# Altium project pca10095.PrjPCB (part 1 of 4)
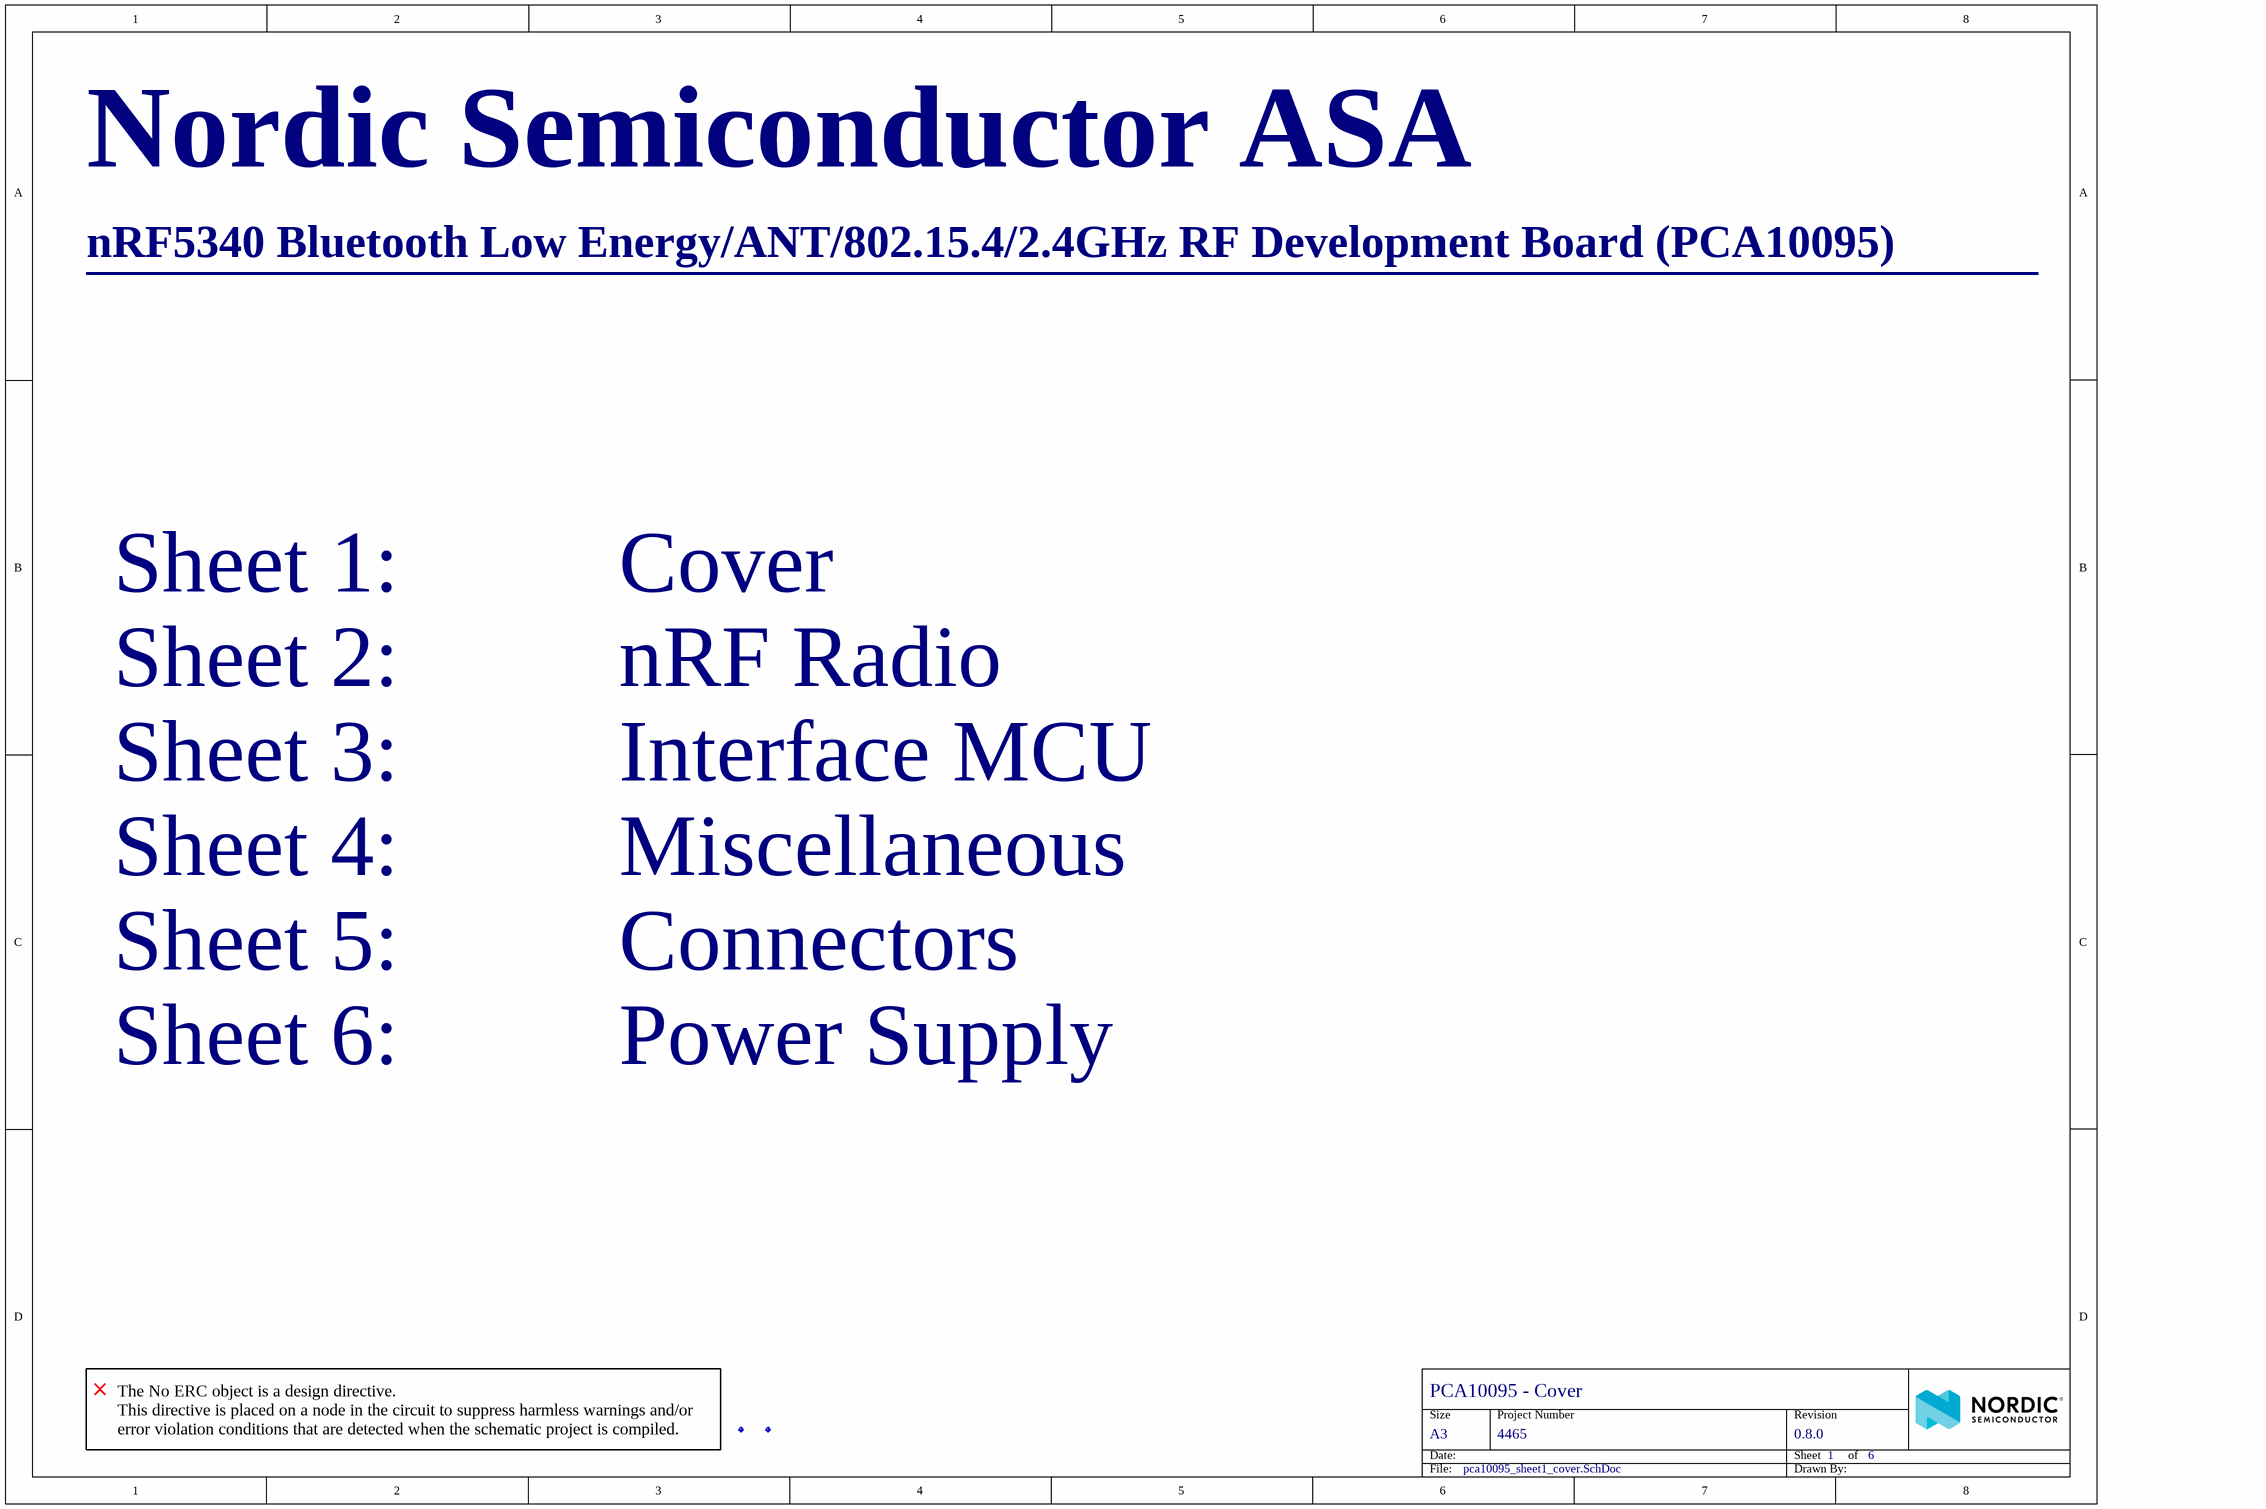
[diagram p0: pca10095_sheet1_cover.SchDoc]
Author: GETR; BoardThickness: 1.6mm; BoardTitle: nRF5340 Bluetooth Smart/ANT/802.15.4/2.4GHz RF Development Board; NrOfLayers: 4; Organization: Nordic Semiconductor; PCAName: PCA10095; PCBNumber: 400432; PCBRevision: 0121GETR; PCBStackup: 4001; ProjectName: nRF53 Development Kit; ProjectNumber: 4465; Revision: 0.8.0; SilkscreenColor: White; SoldermaskColor: Blue; SurfaceFinish: ENIG Gold
6 sheets, 366 parts. Net scope: global (net labels, ports and power ports of the same name join across sheets).
Board file: 400432.PcbDoc
Sheets:
  pca10095_sheet1_cover.SchDoc
  pca10095_sheet2_nrf5340_mcu.SchDoc
  pca10095_sheet3_interface_mcu.SchDoc
  pca10095_sheet4_misc.SchDoc
  pca10095_sheet5_connectors.SchDoc
  pca10095_sheet6_power_supply.SchDoc

## Sheet pca10095_sheet1_cover.SchDoc: PCA10095 - Cover
size A3; Organization: Nordic Semiconductor; DocumentNumber: 1; Revision: 0.8.0; SheetNumber: 1; SheetTotal: 6; Author: GETR; CompanyName: Nordic Semiconductor; DrawnBy: GETR; ProjectName: nRF53 Development Kit

### Parts
Fid1  Fiducial mark  [Fiducial]  (value not drawn)
Fid2  Fiducial mark  [Fiducial]  (value not drawn)

### Notes on the sheet
- Nordic Semiconductor ASA
- nRF5340 Bluetooth Low Energy/ANT/802.15.4/2.4GHz RF Development Board (PCA10095)
- ________________________________________________________________
- Sheet 1:          Cover
- Sheet 2:          nRF Radio
- Sheet 3:          Interface MCU
- Sheet 4:          Miscellaneous
- Sheet 5:          Connectors
- Sheet 6:          Power Supply
- (near Fid1) The No ERC object is a design directive.
  This directive is placed on a node in the circuit to suppress harmless warnings and/or error violation conditions that are detected when the schematic project is compiled.
- Size
- Date:
- A3
- Project Number
- Sheet         of
- Revision
- File:
- Drawn By:

### Library data of the parts
Fid1 Fid2 = Fid-Mark: Artikkelnr Noca: N.A.; Part Number: Fid-Mark; Manufacturer: *; Manufacturer Part Number: *; LatestRevisionDate: 2009-12-12; Pin Count: 1; Publisher: Nordic Semiconductor; Published: 2009-12-12; Value: *; Note: *; Footprint Doc: Fiducial; Part number IPS: N.A.; ComponentLink1URL: *; ComponentLink1Description: Datasheet; ComponentLink2URL: *; ComponentLink2Description: Supplier link; HelpURL: *; Supplier 1: *; Supplier Part Number 1: *; Supplier 2: *; Supplier Part Number 2: *

## Sheet pca10095_sheet2_nrf5340_mcu.SchDoc: PCA10095 - nRF5340 MCU
size A3; Organization: Nordic Semiconductor; DocumentNumber: 2; Revision: 0.8.0; SheetNumber: 2; SheetTotal: 6; Author: GETR; CompanyName: Nordic Semiconductor; DrawnBy: GETR; ProjectName: nRF53 Development Kit
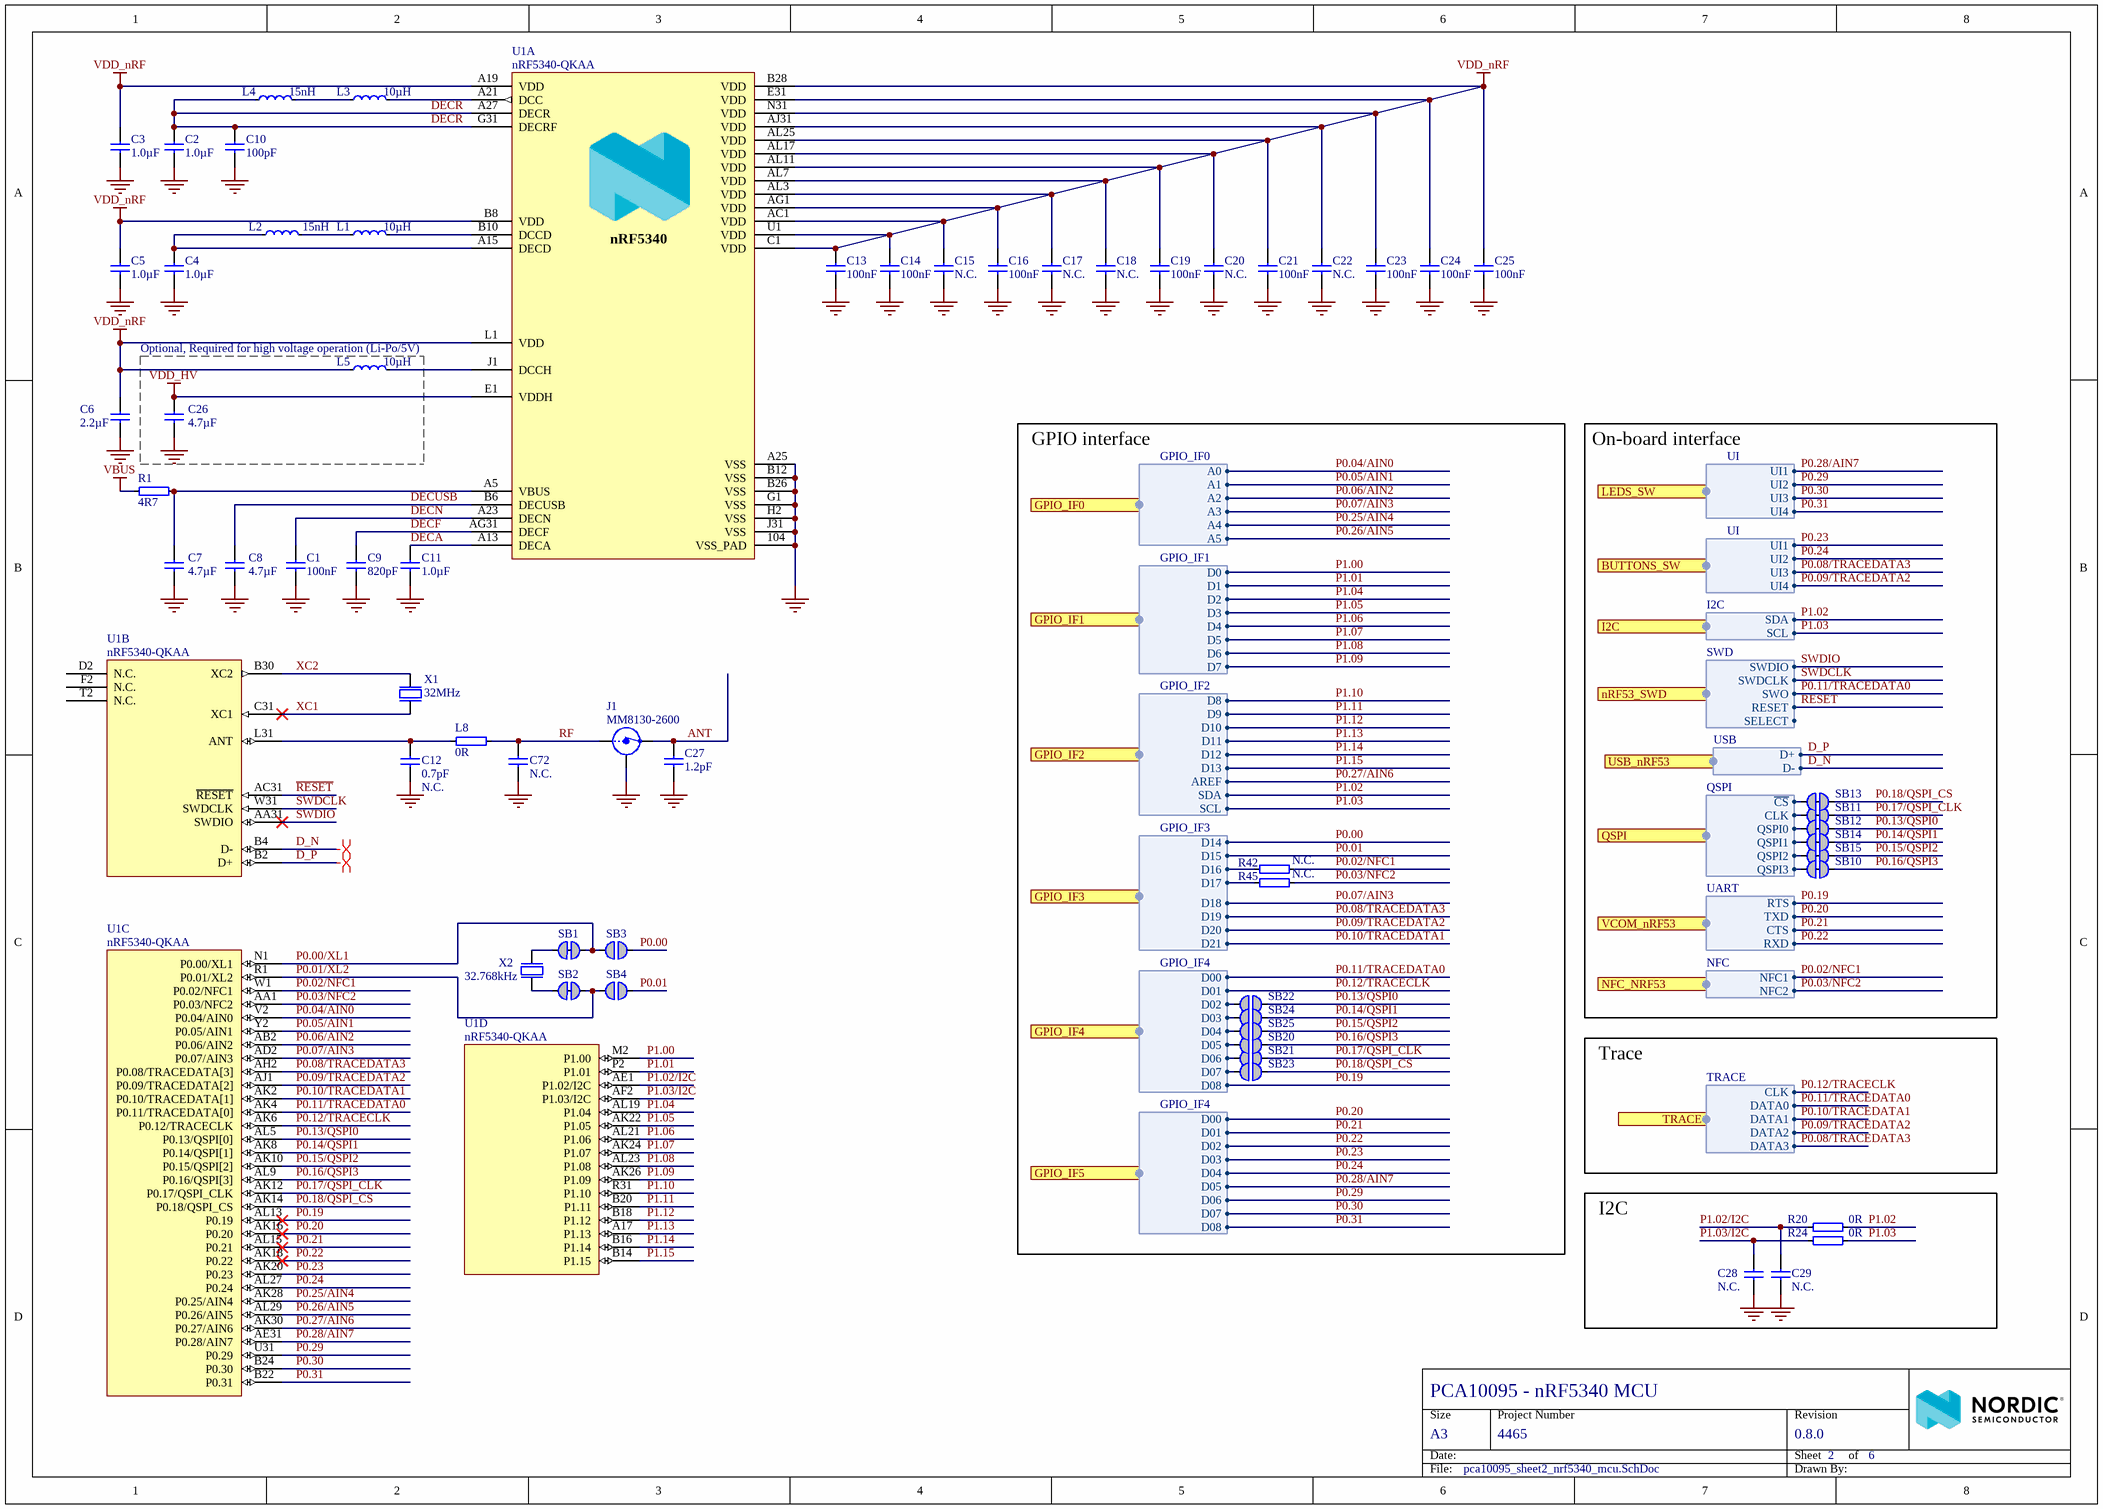
[diagram p1: pca10095_sheet2_nrf5340_mcu.SchDoc]

### Parts
C1  100nF  [CAPC0603X03L_C]
C2  1.0µF  [CAPC1005X04L]
C3  1.0µF  [CAPC1005X04L]
C4  1.0µF  [CAPC1005X04L]
C5  1.0µF  [CAPC1005X04L]
C6  2.2µF  [CAPC1608X06L]
C7  4.7µF  [CAPC1608X06L]
C8  4.7µF  [CAPC1608X06L]
C9  820pF  [CAPC0603X03L_C]
C10  100pF  [CAPC0603X03L_C]
C11  1.0µF  [CAPC1005X04L]
C12  0.7pF  Assembly: N.C.  [CAPC0603X03L_C]
C13  100nF  [CAPC0603X03L_C]
C14  100nF  [CAPC0603X03L_C]
C15  N.C.  [CAPC0603X03L_C]
C16  100nF  [CAPC0603X03L_C]
C17  N.C.  [CAPC0603X03L_C]
C18  N.C.  [CAPC0603X03L_C]
C19  100nF  [CAPC0603X03L_C]
C20  N.C.  [CAPC0603X03L_C]
C21  100nF  [CAPC0603X03L_C]
C22  N.C.  [CAPC0603X03L_C]
C23  100nF  [CAPC0603X03L_C]
C24  100nF  [CAPC0603X03L_C]
C25  100nF  [CAPC0603X03L_C]
C26  4.7µF  [CAPC1608X06L]
C27  1.2pF  [CAPC1005X04L]
C28  N.C.  [CAPC0603X03L_C]
C29  N.C.  [CAPC0603X03L_C]
C72  N.C.  [CAPC0603X03L_C]
J1  MM8130-2600  [COAXIAL-SWF]
L1  10µH  [INDC1608X06L]
L2  15nH  [INDC0603X03L_C]
L3  10µH  [INDC1608X06L]
L4  15nH  [INDC0603X03L_C]
L5  10µH  [INDC1608X06L]
L8  0R  [RESC0603X03L_C]
R1  4R7  [RESC0603X03L_C]
R20  0R  [RESC0603X03L_C]
R24  0R  [RESC0603X03L_C]
R42  N.C.  [RESC0603X03L_C]
R45  N.C.  [RESC0603X03L_C]
SB1  Solderbridge  [Solderbridge_Shorted]  (value not drawn)  (net tie, no BOM)
SB2  Solderbridge  [Solderbridge_Shorted]  (value not drawn)  (net tie, no BOM)
SB3  Solderbridge  [Solderbridge]  (value not drawn)  (no BOM)
SB4  Solderbridge  [Solderbridge]  (value not drawn)  (no BOM)
SB10  Solderbridge  [Solderbridge_Shorted]  (value not drawn)  (net tie, no BOM)
SB11  Solderbridge  [Solderbridge_Shorted]  (value not drawn)  (net tie, no BOM)
SB12  Solderbridge  [Solderbridge_Shorted]  (value not drawn)  (net tie, no BOM)
SB13  Solderbridge  [Solderbridge_Shorted]  (value not drawn)  (net tie, no BOM)
SB14  Solderbridge  [Solderbridge_Shorted]  (value not drawn)  (net tie, no BOM)
SB15  Solderbridge  [Solderbridge_Shorted]  (value not drawn)  (net tie, no BOM)
SB20  Solderbridge  [Solderbridge]  (value not drawn)  (no BOM)
SB21  Solderbridge  [Solderbridge]  (value not drawn)  (no BOM)
SB22  Solderbridge  [Solderbridge]  (value not drawn)  (no BOM)
SB23  Solderbridge  [Solderbridge]  (value not drawn)  (no BOM)
SB24  Solderbridge  [Solderbridge]  (value not drawn)  (no BOM)
SB25  Solderbridge  [Solderbridge]  (value not drawn)  (no BOM)
U1  nRF5340-QKAA  [AQFN40P700X700X85_HS-99N]  (parts A,B,C,D of 4)
X1  32MHz  [BT-XTAL_2016]
X2  32.768kHz  [XTAL_2012]

### Blocks framed on the sheet
Optional, Required for high voltage operation (Li-Po/5V): C26 L5
GPIO interface: R42 R45 SB20-SB25
On-board interface: SB10-SB15
I2C: C28 C29 R20 R24

### Ports
BUTTONS_SW (harness UI), GPIO_IF0 (harness GPIO_IF0), GPIO_IF1 (harness GPIO_IF1), GPIO_IF2 (harness GPIO_IF2), GPIO_IF3 (harness GPIO_IF3), GPIO_IF4 (harness GPIO_IF4), GPIO_IF5 (harness GPIO_IF4), I2C (harness I2C), LEDS_SW (harness UI), NFC_NRF53 (harness NFC), nRF53_SWD (harness SWD), QSPI (harness QSPI), TRACE (harness TRACE), USB_nRF53 (harness USB), VCOM_nRF53 (harness UART)

### Harnesses
QSPI: ~{CS}, QSPI0, CLK, QSPI1, QSPI2, QSPI3
SWD: SWDIO, SWDCLK, SWO, RESET, SELECT
UI: UI4, UI3, UI2, UI1
USB: D+, D-
TRACE: CLK, DATA0, DATA1, DATA3, DATA2
NFC: NFC2, NFC1
UART: RTS, CTS, RXD, TXD
GPIO_IF1: D0, D1, D2, D3, D4, D5, D6, D7
GPIO_IF2: D8, D9, D10, D11, D12, D13, AREF, SDA, SCL
GPIO_IF0: A0, A1, A2, A3, A4, A5
GPIO_IF3: D14, D15, D16, D17, D18, D19, D20, D21
I2C: SCL, SDA
GPIO_IF4: D00, D01, D02, D03, D04, D05, D06, D07, D08

### Nets
GND: C1.2 C2.1 C3.2 C4.1 C5.1 C6.2 C7.2 C8.2 C9.1 C10.2 C11.1 C12.1 C13.2 C14.2 C15.2 C16.2 C17.2 C18.2 C19.2 C20.2 C21.2 C22.2 C23.2 C24.2 C25.2 C26.2 C27.2 C28.1 C29.1 C72.1 J1.2(Shield) U1.104(VSS_PAD) U1.A25(VSS) U1.B12(VSS) U1.B26(VSS) U1.G1(VSS) U1.H2(VSS) U1.J31(VSS) X1.2(GND) X1.4(GND)
VBUS: R1.1
VDD_HV: C26.1 U1.E1(VDDH)
VDD_nRF: C3.1 C5.2 C6.1 C13.1 C14.1 C15.1 C16.1 C17.1 C18.1 C19.1 C20.1 C21.1 C22.1 C23.1 C24.1 C25.1 L5.1 U1.A19(VDD) U1.AC1(VDD) U1.AG1(VDD) U1.AJ31(VDD) U1.AL3(VDD) U1.AL7(VDD) U1.AL11(VDD) U1.AL17(VDD) U1.AL25(VDD) U1.B8(VDD) U1.B28(VDD) U1.C1(VDD) U1.E31(VDD) U1.L1(VDD) U1.N31(VDD) U1.U1(VDD)
ANT: C27.1 J1.3(OUT)
D_N: U1.B4(D-) ; port USB_nRF53.D-
D_P: U1.B2(D+) ; port USB_nRF53.D+
DECA: C11.2 U1.A13(DECA)
DECF: C9.2 U1.AG31(DECF)
DECN: C1.1 U1.A23(DECN)
DECR: C2.2 C10.1 L4.1 U1.A27(DECR) U1.G31(DECRF)
DECUSB: C8.1 U1.B6(DECUSB)
MX25_~{CS}: SB13.2 ; port QSPI.~{CS}
MX25_SCLK: SB11.2 ; port QSPI.CLK
MX25_SIO0: SB12.2 ; port QSPI.QSPI0
MX25_SIO1: SB14.2 ; port QSPI.QSPI1
MX25_SIO2: SB15.2 ; port QSPI.QSPI2
MX25_SIO3: SB10.2 ; port QSPI.QSPI3
P0.00: SB3.2 ; port GPIO_IF3.D14
P0.00/XL1: SB1.2 SB3.1 U1.N1(P0.00/XL1)
P0.01: SB4.2 ; port GPIO_IF3.D15
P0.01/XL2: SB2.2 SB4.1 U1.R1(P0.01/XL2)
P0.02/NFC1: R42.2 U1.W1(P0.02/NFC1) ; port NFC_NRF53.NFC1
P0.03/NFC2: R45.2 U1.AA1(P0.03/NFC2) ; port NFC_NRF53.NFC2
P0.04/AIN0: U1.V2(P0.04/AIN0) ; port GPIO_IF0.A0
P0.05/AIN1: U1.Y2(P0.05/AIN1) ; port GPIO_IF0.A1
P0.06/AIN2: U1.AB2(P0.06/AIN2) ; port GPIO_IF0.A2
P0.07/AIN3: U1.AD2(P0.07/AIN3) ; port GPIO_IF0.A3, port GPIO_IF3.D18
P0.08/TRACEDATA3: U1.AH2(P0.08/TRACEDATA[3]) ; port BUTTONS_SW.UI3, port TRACE.DATA3, port GPIO_IF3.D19
P0.09/TRACEDATA2: U1.AJ1(P0.09/TRACEDATA[2]) ; port BUTTONS_SW.UI4, port TRACE.DATA2, port GPIO_IF3.D20
P0.10/TRACEDATA1: U1.AK2(P0.10/TRACEDATA[1]) ; port TRACE.DATA1, port GPIO_IF3.D21
P0.11/TRACEDATA0: U1.AK4(P0.11/TRACEDATA[0]) ; port nRF53_SWD.SWO, port TRACE.DATA0, port GPIO_IF4.D00
P0.12/TRACECLK: U1.AK6(P0.12/TRACECLK) ; port TRACE.CLK, port GPIO_IF4.D01
P0.13/QSPI0: SB12.1 SB22.1 U1.AL5(P0.13/QSPI[0])
P0.14/QSPI1: SB14.1 SB24.1 U1.AK8(P0.14/QSPI[1])
P0.15/QSPI2: SB15.1 SB25.1 U1.AK10(P0.15/QSPI[2])
P0.16/QSPI3: SB10.1 SB20.1 U1.AL9(P0.16/QSPI[3])
P0.17/QSPI_CLK: SB11.1 SB21.1 U1.AK12(P0.17/QSPI_CLK)
P0.18/QSPI_CS: SB13.1 SB23.1 U1.AK14(P0.18/QSPI_CS)
P0.19: U1.AL13(P0.19) ; port VCOM_nRF53.RTS, port GPIO_IF4.D08
P0.20: U1.AK16(P0.20) ; port VCOM_nRF53.TXD, port GPIO_IF5.D00
P0.21: U1.AL15(P0.21) ; port VCOM_nRF53.CTS, port GPIO_IF5.D01
P0.22: U1.AK18(P0.22) ; port VCOM_nRF53.RXD, port GPIO_IF5.D02
P0.23: U1.AK20(P0.23) ; port BUTTONS_SW.UI1, port GPIO_IF5.D03
P0.24: U1.AL27(P0.24) ; port BUTTONS_SW.UI2, port GPIO_IF5.D04
P0.25/AIN4: U1.AK28(P0.25/AIN4) ; port GPIO_IF0.A4
P0.26/AIN5: U1.AL29(P0.26/AIN5) ; port GPIO_IF0.A5
P0.27/AIN6: U1.AK30(P0.27/AIN6) ; port GPIO_IF2.AREF
P0.28/AIN7: U1.AE31(P0.28/AIN7) ; port LEDS_SW.UI1, port GPIO_IF5.D05
P0.29: U1.U31(P0.29) ; port LEDS_SW.UI2, port GPIO_IF5.D06
P0.30: U1.B24(P0.30) ; port LEDS_SW.UI3, port GPIO_IF5.D07
P0.31: U1.B22(P0.31) ; port LEDS_SW.UI4, port GPIO_IF5.D08
P1.00: U1.M2(P1.00) ; port GPIO_IF1.D0
P1.01: U1.P2(P1.01) ; port GPIO_IF1.D1
P1.02: R20.1 ; port GPIO_IF2.SDA, port I2C.SDA
P1.02/I2C: C29.2 R20.2 U1.AE1(P1.02/I2C)
P1.03: R24.1 ; port GPIO_IF2.SCL, port I2C.SCL
P1.03/I2C: C28.2 R24.2 U1.AF2(P1.03/I2C)
P1.04: U1.AL19(P1.04) ; port GPIO_IF1.D2
P1.05: U1.AK22(P1.05) ; port GPIO_IF1.D3
P1.06: U1.AL21(P1.06) ; port GPIO_IF1.D4
P1.07: U1.AK24(P1.07) ; port GPIO_IF1.D5
P1.08: U1.AL23(P1.08) ; port GPIO_IF1.D6
P1.09: U1.AK26(P1.09) ; port GPIO_IF1.D7
P1.10: U1.R31(P1.10) ; port GPIO_IF2.D8
P1.11: U1.B20(P1.11) ; port GPIO_IF2.D9
P1.12: U1.B18(P1.12) ; port GPIO_IF2.D10
P1.13: U1.A17(P1.13) ; port GPIO_IF2.D11
P1.14: U1.B16(P1.14) ; port GPIO_IF2.D12
P1.15: U1.B14(P1.15) ; port GPIO_IF2.D13
~{RESET}: U1.AC31(~{RESET}) ; port nRF53_SWD.RESET
RF: C72.2 J1.1(IN) L8.2
SWDCLK: U1.W31(SWDCLK) ; port nRF53_SWD.SWDCLK
SWDIO: U1.AA31(SWDIO) ; port nRF53_SWD.SWDIO
XC1: U1.C31(XC1) X1.1(inp)
XC2: U1.B30(XC2) X1.3(out)
NetC4_2: C4.2 L2.1 U1.A15(DECD)
NetC7_1: C7.1 R1.2 U1.A5(VBUS)
NetC12_2: C12.2 L8.1 U1.L31(ANT)
NetL1_1: L1.1 L2.2
NetL1_2: L1.2 U1.B10(DCCD)
NetL3_1: L3.1 L4.2
NetL3_2: L3.2 U1.A21(DCC)
NetL5_2: L5.2 U1.J1(DCCH)
NetP6_3: R42.1 ; port GPIO_IF3.D16
NetP6_4: R45.1 ; port GPIO_IF3.D17
NetP24_3: SB22.2 ; port GPIO_IF4.D02
NetP24_4: SB24.2 ; port GPIO_IF4.D03
NetP24_5: SB25.2 ; port GPIO_IF4.D04
NetP24_6: SB20.2 ; port GPIO_IF4.D05
NetP24_7: SB21.2 ; port GPIO_IF4.D06
NetP24_8: SB23.2 ; port GPIO_IF4.D07
NetSB1_1: SB1.1 X2.1(inp)
NetSB2_1: SB2.1 X2.2(out)

Not connected (* = marked no-connect by the designer): U1 D2(N.C.) F2(N.C.) T2(N.C.)

### Layout directives
differential pair: D_N, D_P

### Notes on the sheet
- D22
- D23
- D24
- D25
- D26
- D27
- D28
- D29
- D30
- D31
- Trace
- D32
- D33
- D34
- D35
- D36
- D37
- D38
- D39
- Size
- Date:
- A3
- Project Number
- Sheet         of
- Revision
- File:
- Drawn By:
- (in symbol nRF5340-QKAAAA, part A) nRF5340

### Library data of the parts
C1 C13 C14 C16 C19 C21 C23-C25 = C0201-100n: Capacitor, X5R, ±10%; Part number IPS: 00000001248; Note: 16V; Artikkelnr Noca: N.A.; Part Number: C0201-100n; Manufacturer: *; Manufacturer Part Number: *; LatestRevisionDate: 2017-11-09; Pin Count: 2; Publisher: Nordic Semiconductor; Published: 2014-11-13; Value: 100nF; Footprint Doc: 0201; ComponentLink1URL: *; ComponentLink1Description: Datasheet; ComponentLink2URL: *; ComponentLink2Description: Supplier link; HelpURL: *; Supplier 1: *; Supplier Part Number 1: *; Supplier 2: *; Supplier Part Number 2: *
C2-C4 C11 = C0402-1µ0: Capacitor, X5R, ±5%; Part number IPS: 00000007786; Note: 6.3V; Artikkelnr Noca: 20039235; Part Number: C0402-1µ0; Manufacturer: *; Manufacturer Part Number: *; LatestRevisionDate: 2016-08-22; Pin Count: 2; Publisher: Nordic Semiconductor; Published: 2009-05-08; Value: 1.0µF; Footprint Doc: 0402; ComponentLink1URL: *; ComponentLink1Description: Datasheet; ComponentLink2URL: *; ComponentLink2Description: Supplier link; HelpURL: *; Supplier 1: Digi-Key; Supplier Part Number 1: 1276-1444-1-ND; Supplier 2: *; Supplier Part Number 2: *
C5 = C0402-1µ0: Capacitor, X5R, ±5%, 6.3V; Part number IPS: 00000007786; Artikkelnr Noca: 20039235; Part Number: C0402-1µ0; Manufacturer: *; Manufacturer Part Number: *; LatestRevisionDate: 2016-08-22; Pin Count: 2; Publisher: Nordic Semiconductor; Published: 2009-05-08; Value: 1.0µF; Note: 6.3V; Footprint Doc: 0402; ComponentLink1URL: *; ComponentLink1Description: Datasheet; ComponentLink2URL: *; ComponentLink2Description: Supplier link; HelpURL: *; Supplier 1: Digi-Key; Supplier Part Number 1: 1276-1444-1-ND; Supplier 2: *; Supplier Part Number 2: *
C6 = C0603-2µ2: Capacitor, X7R, ±10%; Part number IPS: N.A.; Note: 6.3V; Artikkelnr Noca: 20039322; Part Number: C0603-2µ2; Manufacturer: *; Manufacturer Part Number: *; LatestRevisionDate: 2016-10-10; Pin Count: 2; Publisher: Nordic Semiconductor; Published: 2009-05-08; Value: 2.2µF; Footprint Doc: 0603; ComponentLink1URL: *; ComponentLink1Description: Datasheet; ComponentLink2URL: *; ComponentLink2Description: Supplier link; HelpURL: *; Supplier 1: *; Supplier Part Number 1: *; Supplier 2: *; Supplier Part Number 2: *
C7 C8 C26 = C0603-4µ7-10V-X7S: Capacitor, X7S, ±10%; Part number IPS: N.A.; Note: 10V; Artikkelnr Noca: 20030013; Part Number: C0603-4µ7-10V-X7S; LatestRevisionDate: 2016-08-15; Pin Count: 2; Publisher: Nordic Semiconductor; Published: 2016-08-15; Value: 4.7µF; Footprint Doc: 0603; Manufacturer: *; Manufacturer Part Number: *; ComponentLink1URL: *; ComponentLink1Description: Datasheet; ComponentLink2URL: *; ComponentLink2Description: Supplier link; HelpURL: *; Supplier 1: Digi-Key; Supplier Part Number 1: 445-14258-1-ND; Supplier 2: *; Supplier Part Number 2: *
C9 = C0201-820p: Capacitor, X7R, ±10%; Part number IPS: 00000001249; Note: 25V; Artikkelnr Noca: N.A.; Part Number: C0201-820p; Manufacturer: *; Manufacturer Part Number: *; LatestRevisionDate: 2017-11-09; Pin Count: 2; Publisher: Nordic Semiconductor; Published: 2014-11-13; Value: 820pF; Footprint Doc: 0201; ComponentLink1URL: *; ComponentLink1Description: Datasheet; ComponentLink2URL: *; ComponentLink2Description: Supplier link; HelpURL: *; Supplier 1: *; Supplier Part Number 1: *; Supplier 2: *; Supplier Part Number 2: *
C10 = C0201-100p: Capacitor, NP0, ±2%; Part number IPS: 00000007853; Note: 25V; Artikkelnr Noca: N.A.; Part Number: C0201-100p; Manufacturer: *; Manufacturer Part Number: *; LatestRevisionDate: 2017-11-09; Pin Count: 2; Publisher: Nordic Semiconductor; Published: 2014-11-13; Value: 100pF; Footprint Doc: 0201; ComponentLink1URL: *; ComponentLink1Description: Datasheet; ComponentLink2URL: *; ComponentLink2Description: Supplier link; HelpURL: *; Supplier 1: *; Supplier Part Number 1: *; Supplier 2: *; Supplier Part Number 2: *
C12 = C0201-0.7p: Capacitor, NP0, ±0.05pF; Note: 50V; Artikkelnr Noca: N.A.; Part Number: C0201-0.7p; Manufacturer: *; Manufacturer Part Number: *; LatestRevisionDate: 2018-10-22; Pin Count: 2; Publisher: Nordic Semiconductor; Published: 2014-11-13; Value: 0.7pF; Footprint Doc: 0201; ComponentLink1URL: *; ComponentLink1Description: Datasheet; ComponentLink2URL: *; ComponentLink2Description: Supplier link; HelpURL: *; Supplier 1: *; Supplier Part Number 1: *; Supplier 2: *; Supplier Part Number 2: *; Part number IPS: N.A.
C15 C17 C18 C20 C22 = C0201-N.C.: Not mounted; Note: Chip Cap; Artikkelnr Noca: N.A.; Assembly: Not mounted; Part Number: C0201-N.C.; Manufacturer: *; Manufacturer Part Number: *; LatestRevisionDate: 2014-11-13; Pin Count: 2; Publisher: Nordic Semiconductor; Published: 2014-11-13; Value: N.C.; Footprint Doc: 0201; ComponentLink1URL: *; ComponentLink1Description: Datasheet; ComponentLink2URL: *; ComponentLink2Description: Supplier link; HelpURL: *; Supplier 1: *; Supplier Part Number 1: *; Supplier 2: *; Supplier Part Number 2: *; Part number IPS: N.A.
C27 = C0402-1.2p: Capacitor, NP0, ±0.1pF; Part number IPS: 00000005410; Note: 50V; Artikkelnr Noca: 20029157; Artikkelnr Simpro: N.A.; Part Number: C0402-1.2p; Manufacturer: *; Manufacturer Part Number: *; Datasheet: *; LatestRevisionDate: 2011-05-11; Pin Count: 2; Publisher: Nordic Semiconductor; Published: 2009-05-08; Value: 1.2pF; Supplier: *; Supplier part number: *; 2nd source Supplier: *; 2nd source part number: *; Footprint Doc: 0402
C28 C29 = C0201-N.C.: Not mounted; Assembly: Not mounted; Note: Chip Cap; Artikkelnr Noca: N.A.; Part Number: C0201-N.C.; Manufacturer: *; Manufacturer Part Number: *; Footprint Doc: 0201; LatestRevisionDate: 2014-11-13; Pin Count: 2; Publisher: Nordic Semiconductor; Published: 2014-11-13; Value: N.C.; Part number IPS: N.A.; ComponentLink1URL: *; ComponentLink1Description: Datasheet; ComponentLink2URL: *; ComponentLink2Description: Supplier link; HelpURL: *; Supplier 1: *; Supplier Part Number 1: *; Supplier 2: *; Supplier Part Number 2: *
C72 = C0201-N.C.: Not mounted; Note: Chip Cap; Assembly: Not mounted; Artikkelnr Noca: N.A.; Part Number: C0201-N.C.; LatestRevisionDate: 2014-11-13; Pin Count: 2; Publisher: Nordic Semiconductor; Published: 2014-11-13; Value: N.C.; Footprint Doc: 0201; Manufacturer: *; Manufacturer Part Number: *; Part number IPS: N.A.; ComponentLink1URL: *; ComponentLink1Description: Datasheet; ComponentLink2URL: *; ComponentLink2Description: Supplier link; HelpURL: *; Supplier 1: *; Supplier Part Number 1: *; Supplier 2: *; Supplier Part Number 2: *
J1 = MM8130-2600: Coaxial Connector with Switch; Manufacturer: Murata; 2nd source part number: 81-MM8130-2600RA2; Artikkelnr Noca: 55029011; Artikkelnr Simpro: N.A.; Part Number: MM8130-2600; Manufacturer Part Number: MM8130-2600; Datasheet: http://www.murata.com/products/catalog/pdf/o33e.pdf; LatestRevisionDate: 2014-04-24; Pin Count: 3; Publisher: Nordic Semiconductor; Published: 2014-04-24; Value: MM8130-2600; Note: *; Supplier: Digi-Key; Supplier part number: 490-4981-1-ND; 2nd source Supplier: Mouser; Footprint Doc: COAXIAL-SWF
L1 L3 L5 = L0603-10µ-TDK: Inductor, 250mA, ±20%, 1.05ohm. -55°C ~ 125°C; Manufacturer: TDK; Manufacturer Part Number: MLZ1608M100WTD25; Part Number: L0603-10µ-TDK; LatestRevisionDate: 2012-09-19; Pin Count: 2; Publisher: Nordic Semiconductor; Published: 2019-05-06; Value: 10µH; Note: *; Artikkelnr Noca: *; Footprint Doc: 0603; ComponentLink1URL: *; ComponentLink1Description: Datasheet; ComponentLink2URL: *; ComponentLink2Description: Supplier link; HelpURL: https://product.tdk.com/info/en/catalog/datasheets/inductor_automotive_decoupling_mlz1608_en.pdf; Supplier 1: Digi-Key; Supplier Part Number 1: 445-175588-1-ND; Supplier 2: Mouser; Supplier Part Number 2: 810-MLZ1608M100WTD25; Part number IPS: *
L2 L4 = L0201-15n: Inductor, 250mA, ±5%; Manufacturer: Murata; Manufacturer Part Number: LQP03TN15NJ02D; Note: High frequency chip inductor ±10%; Artikkelnr Noca: N.A.; Part Number: L0201-15n; LatestRevisionDate: 2013-04-10; Pin Count: 2; Publisher: Nordic Semiconductor; Published: 2013-04-10; Value: 15nH; Footprint Doc: 0201; ComponentLink1URL: http://search.murata.co.jp/Ceramy/image/img/P02/JELF243C-0015.pdf; ComponentLink1Description: Datasheet; ComponentLink2URL: *; ComponentLink2Description: Supplier link; HelpURL: *; Supplier 1: Digi-Key; Supplier Part Number 1: 490-5570-1-ND; Supplier 2: *; Supplier Part Number 2: *; Part number IPS: N.A.
L8 R20 R24 = R0201-0R: Resistor, ±5%, 0.05W; Part number IPS: 00000003245; Note: Chip Res 5%; Artikkelnr Noca: N.A.; Part Number: R0201-0R; Manufacturer: *; Manufacturer Part Number: *; ComponentLink1URL: *; ComponentLink1Description: Datasheet; ComponentLink2URL: *; ComponentLink2Description: Supplier link; HelpURL: *; Footprint Doc: 0201; LatestRevisionDate: 2017-11-09; Pin Count: 2; Publisher: Nordic Semiconductor; Published: 2014-11-13; Value: 0R; Supplier 1: *; Supplier Part Number 1: *; Supplier 2: *; Supplier Part Number 2: *
R1 = R0201-4R7: Resistor, ±1%, 0.05W; Note: Chip Res 1%; Artikkelnr Noca: N.A.; Part Number: R0201-4R7; Manufacturer: *; Manufacturer Part Number: *; ComponentLink1URL: *; ComponentLink1Description: Datasheet; ComponentLink2URL: *; ComponentLink2Description: Supplier link; HelpURL: *; Footprint Doc: 0201; LatestRevisionDate: 2014-11-13; Pin Count: 2; Publisher: Nordic Semiconductor; Published: 2014-11-13; Value: 4R7; Supplier 1: *; Supplier Part Number 1: *; Supplier 2: *; Supplier Part Number 2: *; Part number IPS: N.A.
R42 R45 = R0201-N.C.: Not mounted; Note: Chip Res; Artikkelnr Noca: N.A.; Part Number: R0201-N.C.; Manufacturer: *; Manufacturer Part Number: *; Footprint Doc: 0201; LatestRevisionDate: 2014-11-13; Pin Count: 2; Publisher: Nordic Semiconductor; Published: 2014-11-13; Value: N.C.; Part number IPS: N.A.; ComponentLink1URL: *; ComponentLink1Description: Datasheet; ComponentLink2URL: *; ComponentLink2Description: Supplier link; HelpURL: *; Supplier 1: *; Supplier Part Number 1: *; Supplier 2: *; Supplier Part Number 2: *
SB1 SB2 SB10-SB15 = Solderbridge Shorted: Shorted Solderbridge; Artikkelnr Noca: N.A.; Part Number: Solderbridge Shorted; Manufacturer: *; Manufacturer Part Number: *; LatestRevisionDate: 2012-08-07; Pin Count: 2; Publisher: Nordic Semiconductor; Published: 2012-08-07; Value: Solderbridge; Note: *; Footprint Doc: Solderbridge_Shorted
  SB1 SB2: Datasheet: *; Supplier: *; Supplier part number: *; 2nd source Supplier: *; 2nd source part number: *; Artikkelnr Simpro: N.A.
  SB10-SB15: Part number IPS: N.A.; ComponentLink1URL: *; ComponentLink1Description: Datasheet; ComponentLink2URL: *; ComponentLink2Description: Supplier link; HelpURL: *; Supplier 1: *; Supplier Part Number 1: *; Supplier 2: *; Supplier Part Number 2: *
SB3 SB4 SB20-SB25 = Solderbridge: Artikkelnr Noca: N.A.; Part Number: Solderbridge; Manufacturer: *; Manufacturer Part Number: *; LatestRevisionDate: 2009-12-14; Pin Count: 2; Publisher: Nordic Semiconductor; Published: 2009-12-14; Value: Solderbridge; Note: *; Footprint Doc: Solderbridge
  SB3 SB4: Datasheet: *; Supplier: *; Supplier part number: *; 2nd source Supplier: *; 2nd source part number: *; Artikkelnr Simpro: N.A.
  SB20-SB25: Part number IPS: N.A.; ComponentLink1URL: *; ComponentLink1Description: Datasheet; ComponentLink2URL: *; ComponentLink2Description: Supplier link; HelpURL: *; Supplier 1: *; Supplier Part Number 1: *; Supplier 2: *; Supplier Part Number 2: *
U1 = nRF5340-QKAAAA: Multi-protocol Bluetooth Low Energy, IEEE 802.15.4, ANT and 2.4GHz proprietary system-on-chip; Manufacturer: Nordic Semiconductor; Artikkelnr Noca: N.A.; Part Number: nRF5340-QKAAAA; Manufacturer Part Number: *; Footprint Doc: AQFN-98; LatestRevisionDate: 2019-03-28; Pin Count: 98; Publisher: Nordic Semiconductor; Published: 2017-01-09; Value: nRF5340-QKAA; Note: *; Part number IPS: N.A.; ComponentLink1URL: *; ComponentLink1Description: Datasheet; ComponentLink2URL: *; ComponentLink2Description: Supplier link; HelpURL: *; Supplier 1: Nordic Semiconductor; Supplier Part Number 1: nRF5340-QKAAAA; Supplier 2: *; Supplier Part Number 2: *
X1 = XTAL_SMD2016_32MHz_8pF_Kyocera_HT: XTAL SMD 2016, 32MHz, Cl=8pF, ±40ppm, -40°C ~ 105°C; Manufacturer Part Number: CX2016DB32000D0WRRC1; Note: XTAL SMD 32.000MHz; Artikkelnr Noca: N.A.; Part Number: XTAL_SMD2016_32MHz_8pF_Kyocera_HT; Manufacturer: Kyocera; LatestRevisionDate: 2015-12-22; Pin Count: 4; Publisher: Nordic Semiconductor; Published: 2015-12-23; Value: 32MHz; Footprint Doc: XTAL_2016; Part number IPS: N.A.; ComponentLink1URL: *; ComponentLink1Description: Datasheet; ComponentLink2URL: *; ComponentLink2Description: Supplier link; HelpURL: http://projecttools.nordicsemi.no/confluence/download/attachments/16544873/CX2016DB32000D0WRRC1%2015236-00.pdf?version=1&modificationDate=1441719736227&api=v2; Supplier 1: *; Supplier Part Number 1: *; Supplier 2: *; Supplier Part Number 2: *
X2 = XTAL_SMD2012_32.768kHz_9pF_General: XTAL SMD 2012, 32.768kHz, Cl=9pF, Total Tol: ±50ppm; Note: XTAL SMD 32.768kHz; Artikkelnr Noca: N.A.; Part Number: XTAL_SMD2012_32.768kHz_9pF_General; Manufacturer: *; Manufacturer Part Number: *; LatestRevisionDate: 2017-01-11; Pin Count: 2; Publisher: Nordic Semiconductor; Published: 2016-08-19; Value: 32.768kHz; Footprint Doc: XTAL_2012; Part number IPS: N.A.; ComponentLink1URL: *; ComponentLink1Description: Datasheet; ComponentLink2URL: *; ComponentLink2Description: Supplier link; HelpURL: *; Supplier 1: *; Supplier Part Number 1: *; Supplier 2: *; Supplier Part Number 2: *

## Sheet pca10095_sheet3_interface_mcu.SchDoc: PCA10095 - Interface MCU
size A3; Organization: Nordic Semiconductor; DocumentNumber: 3; Revision: 0.8.0; SheetNumber: 3; SheetTotal: 6; Author: GETR; CompanyName: Nordic Semiconductor; DrawnBy: GETR; ProjectName: nRF53 Development Kit
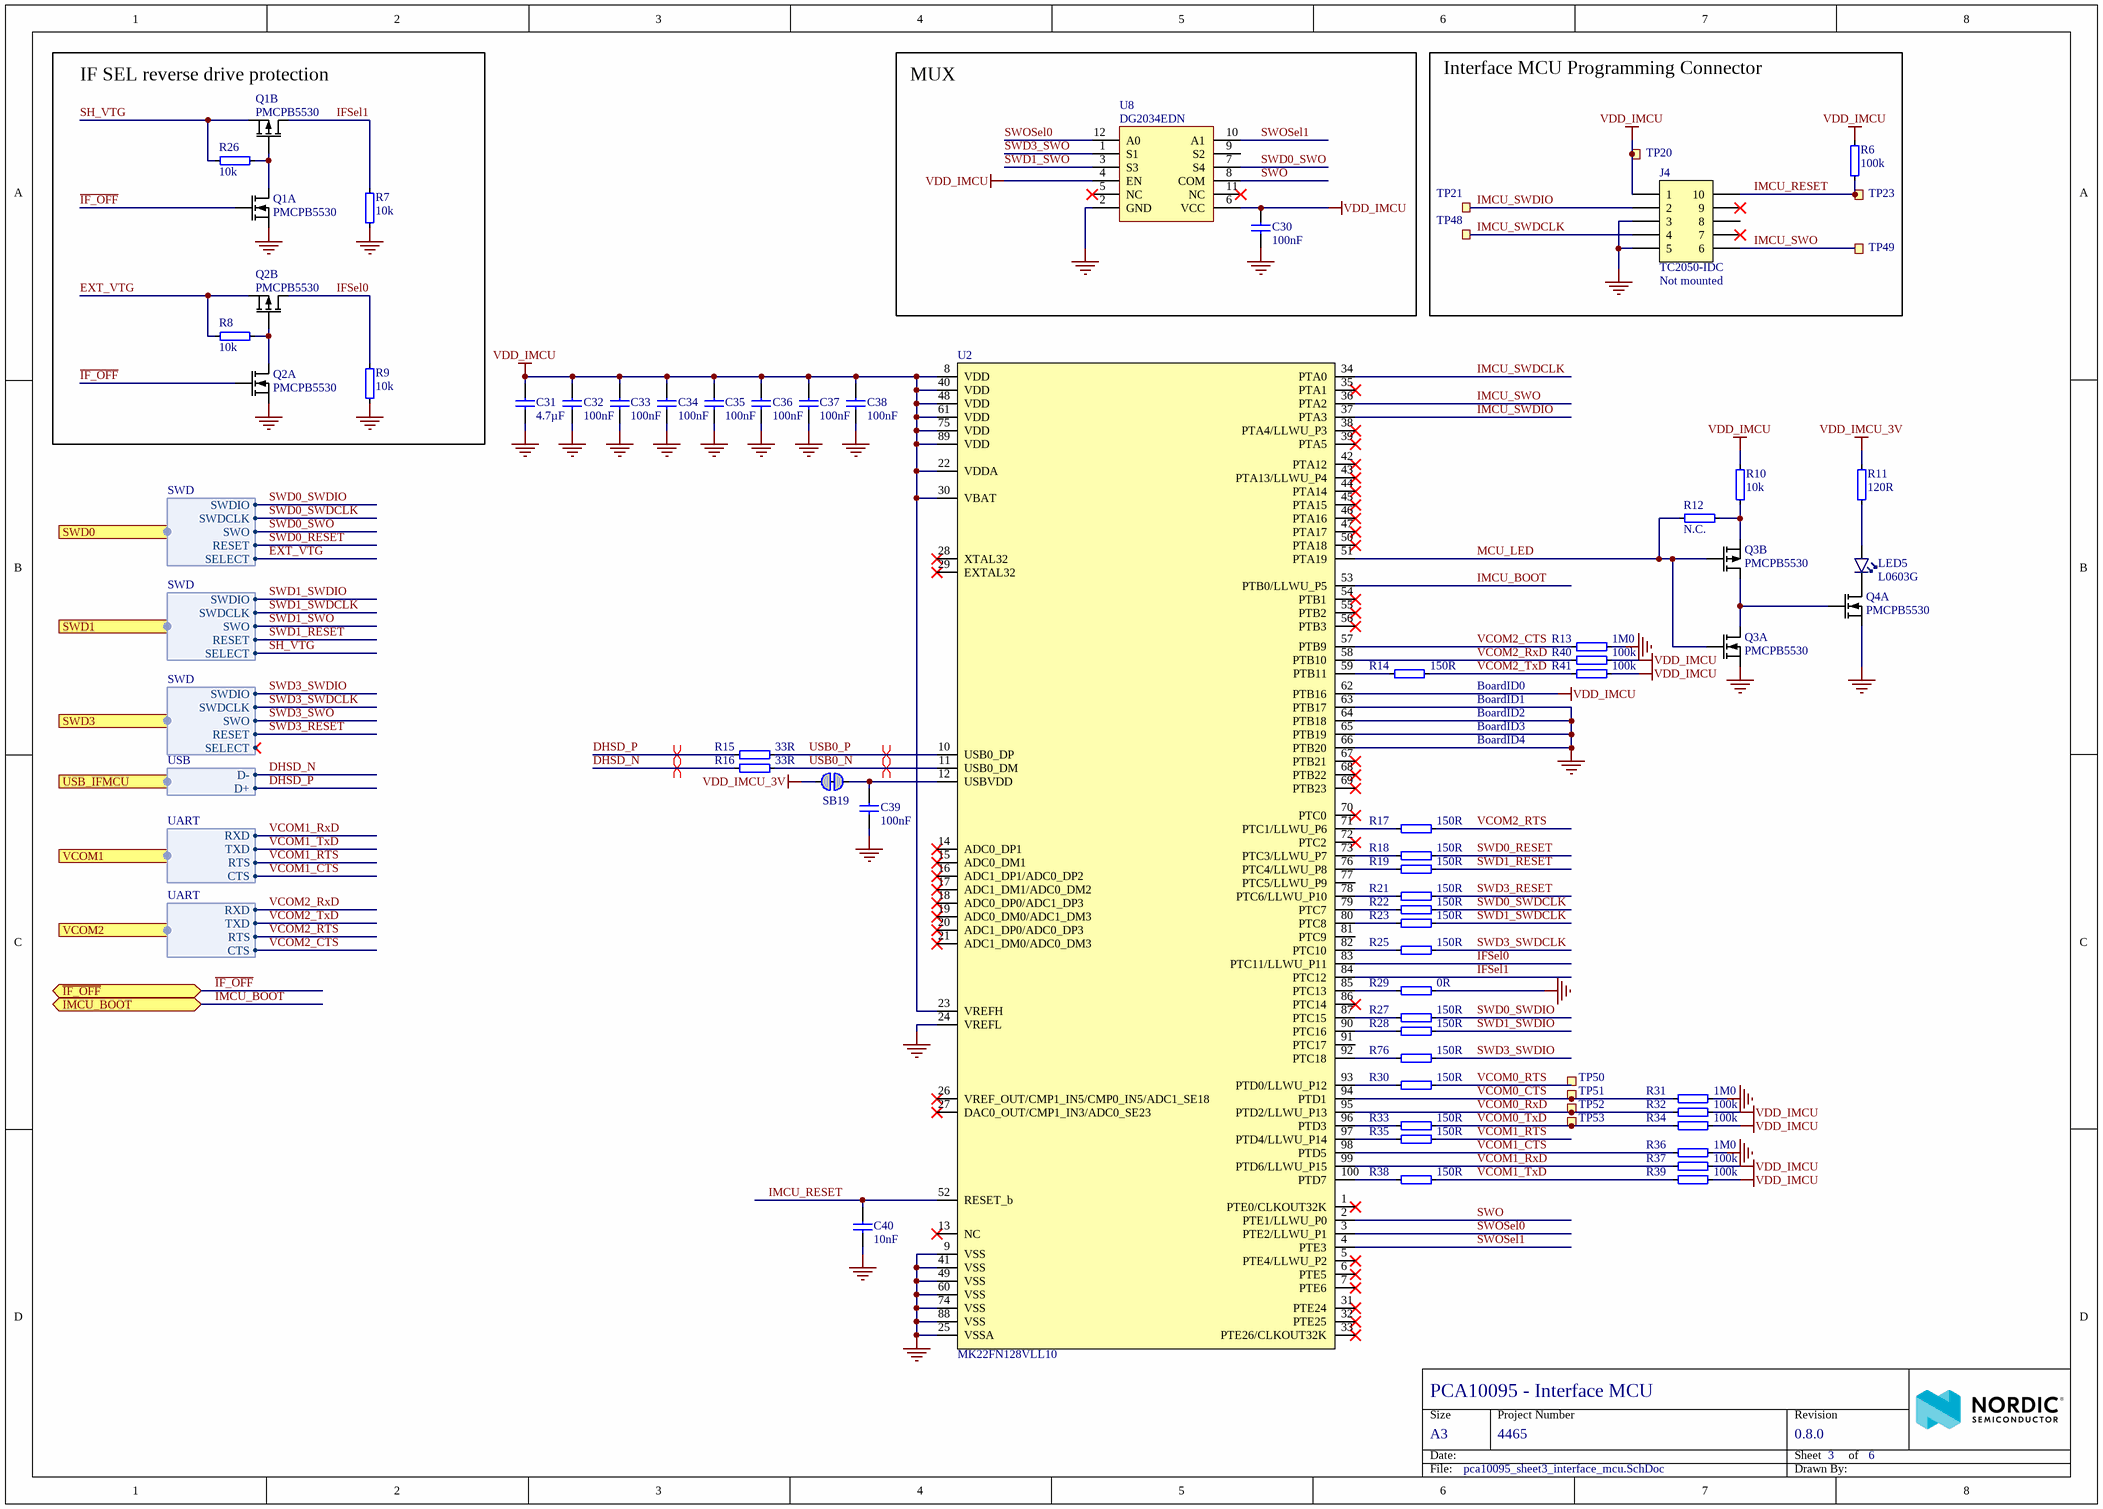
[diagram p2: pca10095_sheet3_interface_mcu.SchDoc]

### Parts
C30  100nF  [CAPC0603X03L_C]
C31  4.7µF  [CAPC1005X04L]
C32  100nF  [CAPC0603X03L_C]
C33  100nF  [CAPC0603X03L_C]
C34  100nF  [CAPC0603X03L_C]
C35  100nF  [CAPC0603X03L_C]
C36  100nF  [CAPC0603X03L_C]
C37  100nF  [CAPC0603X03L_C]
C38  100nF  [CAPC0603X03L_C]
C39  100nF  [CAPC0603X03L_C]
C40  10nF  [CAPC0603X03L_C]
J4  TC2050-IDC  Assembly: Not mounted  [TC2050-IDC-NLFP]  (no BOM)
LED5  L0603G  [LED_0603_G]
Q1  PMCPB5530  [PMCPB5530X]  (parts A,B of 2)
Q2  PMCPB5530  [PMCPB5530X]  (parts A,B of 2)
Q3  PMCPB5530  [PMCPB5530X]  (parts A,B of 2)
Q4  PMCPB5530  [PMCPB5530X]  (part A of 2)
R6  100k  [RESC0603X03L_C]
R7  10k  [RESC0603X03L_C]
R8  10k  [RESC0603X03L_C]
R9  10k  [RESC0603X03L_C]
R10  10k  [RESC0603X03L_C]
R11  120R  [RESC0603X03L_C]
R12  N.C.  [RESC0603X03L_C]
R13  1M0  [RESC0603X03L_C]
R14  150R  [RESC0603X03L_C]
R15  33R  [RESC0603X03L_C]
R16  33R  [RESC0603X03L_C]
R17  150R  [RESC0603X03L_C]
R18  150R  [RESC0603X03L_C]
R19  150R  [RESC0603X03L_C]
R21  150R  [RESC0603X03L_C]
R22  150R  [RESC0603X03L_C]
R23  150R  [RESC0603X03L_C]
R25  150R  [RESC0603X03L_C]
R26  10k  [RESC0603X03L_C]
R27  150R  [RESC0603X03L_C]
R28  150R  [RESC0603X03L_C]
R29  0R  [RESC0603X03L_C]
R30  150R  [RESC0603X03L_C]
R31  1M0  [RESC0603X03L_C]
R32  100k  [RESC0603X03L_C]
R33  150R  [RESC0603X03L_C]
R34  100k  [RESC0603X03L_C]
R35  150R  [RESC0603X03L_C]
R36  1M0  [RESC0603X03L_C]
R37  100k  [RESC0603X03L_C]
R38  150R  [RESC0603X03L_C]
R39  100k  [RESC0603X03L_C]
R40  100k  [RESC0603X03L_C]
R41  100k  [RESC0603X03L_C]
R76  150R  [RESC0603X03L_C]
SB19  Solderbridge  [Solderbridge_Shorted]  (value not drawn)  (net tie, no BOM)
TP20  Ø1.5mm,SMD  [TP_SMD_Ø1.5mm]  (value not drawn)  (no BOM)
TP21  Ø1.5mm,SMD  [TP_SMD_Ø1.5mm]  (value not drawn)  (no BOM)
TP23  Ø1.5mm,SMD  [TP_SMD_Ø1.5mm]  (value not drawn)  (no BOM)
TP48  Ø1.5mm,SMD  [TP_SMD_Ø1.5mm]  (value not drawn)  (no BOM)
TP49  Ø1.5mm,SMD  [TP_SMD_Ø1.5mm]  (value not drawn)  (no BOM)
TP50  Ø1.0mm,SMD  [TP_SMD_Ø1.0mm]  (value not drawn)  (no BOM)
TP51  Ø1.0mm,SMD  [TP_SMD_Ø1.0mm]  (value not drawn)  (no BOM)
TP52  Ø1.0mm,SMD  [TP_SMD_Ø1.0mm]  (value not drawn)  (no BOM)
TP53  Ø1.0mm,SMD  [TP_SMD_Ø1.0mm]  (value not drawn)  (no BOM)
U2  MK22FN128VLL10  [TSQFP50P1600X1600X160-100N]
U8  DG2034EDN  [DG2034EDN]

### Blocks framed on the sheet
IF SEL reverse drive protection: Q1 Q2 R7-R9 R26
MUX: C30 U8
Interface MCU Programming Connector: J4 R6 TP20 TP21 TP23 TP48 TP49

### Ports
IMCU_BOOT (bidir), SWD0 (harness SWD), SWD1 (harness SWD), SWD3 (harness SWD), USB_IFMCU (harness USB), VCOM1 (harness UART), VCOM2 (harness UART), ~{IF_OFF} (bidir)

### Harnesses
SWD: SWDIO, SWDCLK, SWO, RESET, SELECT
USB: D+, D-
UART: RTS, CTS, RXD, TXD

### Nets
GND: C30.2 C31.1 C32.1 C33.1 C34.2 C35.1 C36.1 C37.1 C38.1 C39.2 C40.1 J4.3 J4.5 Q1.1(S1) Q2.1(S1) Q3.1(S1) Q4.1(S1) R7.1 R9.1 R13.2 R29.2 R31.2 R36.2 U2.9(VSS) U2.24(VREFL) U2.25(VSSA) U2.41(VSS) U2.49(VSS) U2.60(VSS) U2.63(PTB17) U2.64(PTB18) U2.65(PTB19) U2.66(PTB20) U2.74(VSS) U2.88(VSS) U8.2(GND)
VDD_IMCU: C30.1 C31.2 C32.2 C33.2 C34.1 C35.2 C36.2 C37.2 C38.2 J4.1 R6.2 R10.2 R32.2 R34.2 R37.2 R39.2 R40.2 R41.2 TP20.1 U2.8(VDD) U2.22(VDDA) U2.23(VREFH) U2.30(VBAT) U2.40(VDD) U2.48(VDD) U2.61(VDD) U2.62(PTB16) U2.75(VDD) U2.89(VDD) U8.4(EN) U8.6(VCC)
VDD_IMCU_3V: R11.2 SB19.2
DHSD_N: R16.1 ; port USB_IFMCU.D-
DHSD_P: R15.1 ; port USB_IFMCU.D+
EXT_VTG: Q2.4(S2) R8.1 ; port SWD0.SELECT
~{IF_OFF}: Q1.2(G1) Q2.2(G1) ; port ~{IF_OFF}
IFSel0: Q2.3(D2) R9.2 U2.83(PTC11/LLWU_P11)
IFSel1: Q1.3(D2) R7.2 U2.84(PTC12)
IMCU_BOOT: U2.53(PTB0/LLWU_P5) ; port IMCU_BOOT
IMCU_RESET: C40.2 J4.10 R6.1 TP23.1 U2.52(RESET_b)
IMCU_SWDCLK: J4.4 TP48.1 U2.34(PTA0)
IMCU_SWDIO: J4.2 TP21.1 U2.37(PTA3)
IMCU_SWO: J4.6 TP49.1 U2.36(PTA2)
MCU_LED: Q3.2(G1) Q3.5(G2) R12.1 U2.51(PTA19)
SH_VTG: Q1.4(S2) R26.1 ; port SWD1.SELECT
SWD0_RESET: R18.2 ; port SWD0.RESET
SWD0_SWDCLK: R22.2 ; port SWD0.SWDCLK
SWD0_SWDIO: R27.2 ; port SWD0.SWDIO
SWD0_SWO: U8.7(S4) ; port SWD0.SWO
SWD1_RESET: R19.2 ; port SWD1.RESET
SWD1_SWDCLK: R23.2 ; port SWD1.SWDCLK
SWD1_SWDIO: R28.2 ; port SWD1.SWDIO
SWD1_SWO: U8.3(S3) ; port SWD1.SWO
SWD3_RESET: R21.2 ; port SWD3.RESET
SWD3_SWDCLK: R25.2 ; port SWD3.SWDCLK
SWD3_SWDIO: R76.2 ; port SWD3.SWDIO
SWD3_SWO: U8.1(S1) ; port SWD3.SWO
SWO: U2.2(PTE1/LLWU_P0) U8.8(COM)
SWOSel0: U2.3(PTE2/LLWU_P1) U8.12(A0)
SWOSel1: U2.4(PTE3) U8.10(A1)
USB0_N: R16.2 U2.11(USB0_DM)
USB0_P: R15.2 U2.10(USB0_DP)
VCOM0_CTS: R31.1 TP51.1 U2.94(PTD1)
VCOM0_RTS: R30.2 TP50.1
VCOM0_RxD: R32.1 TP52.1 U2.95(PTD2/LLWU_P13)
VCOM0_TxD: R33.2 R34.1 TP53.1
VCOM1_CTS: R36.1 U2.98(PTD5) ; port VCOM1.CTS
VCOM1_RTS: R35.2 ; port VCOM1.RTS
VCOM1_RxD: R37.1 U2.99(PTD6/LLWU_P15) ; port VCOM1.RXD
VCOM1_TxD: R38.2 R39.1 ; port VCOM1.TXD
VCOM2_CTS: R13.1 U2.57(PTB9) ; port VCOM2.CTS
VCOM2_RTS: R17.2 ; port VCOM2.RTS
VCOM2_RxD: R40.1 U2.58(PTB10) ; port VCOM2.RXD
VCOM2_TxD: R14.2 R41.1 ; port VCOM2.TXD
NetC39_1: C39.1 SB19.1 U2.12(USBVDD)
NetLED5_1: LED5.1(C) Q4.6(D1)
NetLED5_2: LED5.2(A) R11.1
NetQ1_5: Q1.5(G2) Q1.6(D1) R26.2
NetQ2_5: Q2.5(G2) Q2.6(D1) R8.2
NetQ3_3: Q3.3(D2) Q3.6(D1) Q4.2(G1)
NetQ3_4: Q3.4(S2) R10.1 R12.2
NetR14_1: R14.1 U2.59(PTB11)
NetR17_1: R17.1 U2.71(PTC1/LLWU_P6)
NetR18_1: R18.1 U2.73(PTC3/LLWU_P7)
NetR19_1: R19.1 U2.76(PTC4/LLWU_P8)
NetR21_1: R21.1 U2.78(PTC6/LLWU_P10)
NetR22_1: R22.1 U2.79(PTC7)
NetR23_1: R23.1 U2.80(PTC8)
NetR25_1: R25.1 U2.82(PTC10)
NetR27_1: R27.1 U2.87(PTC15)
NetR28_1: R28.1 U2.90(PTC16)
NetR29_1: R29.1 U2.85(PTC13)
NetR30_1: R30.1 U2.93(PTD0/LLWU_P12)
NetR33_1: R33.1 U2.96(PTD3)
NetR35_1: R35.1 U2.97(PTD4/LLWU_P14)
NetR38_1: R38.1 U2.100(PTD7)
NetR76_1: R76.1 U2.92(PTC18)

Not connected (* = marked no-connect by the designer): J4 7* 8 9*; U2 1(PTE0/CLKOUT32K)* 5(PTE4/LLWU_P2)* 6(PTE5)* 7(PTE6)* 13(NC)* 14(ADC0_DP1)* 15(ADC0_DM1)* 16(ADC1_DP1/ADC0_DP2)* 17(ADC1_DM1/ADC0_DM2)* 18(ADC0_DP0/ADC1_DP3)* 19(ADC0_DM0/ADC1_DM3)* 20(ADC1_DP0/ADC0_DP3)* 21(ADC1_DM0/ADC0_DM3)* 26(VREF_OUT/CMP1_IN5/CMP0_IN5/ADC1_SE18)* 27(DAC0_OUT/CMP1_IN3/ADC0_SE23)* 28(XTAL32)* 29(EXTAL32)* 31(PTE24)* 32(PTE25)* 33(PTE26/CLKOUT32K)* 35(PTA1)* 38(PTA4/LLWU_P3)* 39(PTA5)* 42(PTA12)* 43(PTA13/LLWU_P4)* 44(PTA14)* 45(PTA15)* 46(PTA16)* 47(PTA17)* 50(PTA18)* 54(PTB1)* 55(PTB2)* 56(PTB3)* 67(PTB21)* 68(PTB22)* 69(PTB23)* 70(PTC0)* 72(PTC2)* 77(PTC5/LLWU_P9) 81(PTC9) 86(PTC14)* 91(PTC17); U8 5(NC)* 9(S2) 11(NC)*

### Layout directives
differential pair: DHSD_N, DHSD_P, USB0_N, USB0_P

### Notes on the sheet
- BoardID0
- BoardID1
- BoardID2
- BoardID3
- BoardID4
- Size
- Date:
- A3
- Project Number
- Sheet         of
- Revision
- File:
- Drawn By:

### Library data of the parts
C30 C32-C39 = C0201-100n: as C1 on sheet pca10095_sheet2_nrf5340_mcu; Part Number: C0201-100n; Manufacturer: *; Manufacturer Part Number: *; ComponentLink1URL: *; ComponentLink1Description: Datasheet; ComponentLink2URL: *; ComponentLink2Description: Supplier link; HelpURL: *; Footprint Doc: 0201; LatestRevisionDate: 2017-11-09; Pin Count: 2; Publisher: Nordic Semiconductor; Published: 2014-11-13; Value: 100nF; Supplier 1: *; Supplier Part Number 1: *; Supplier 2: *; Supplier Part Number 2: *
C31 = C0402-4µ7-10V-X5R: CAP CER 4.7UF 10V X5R 0402; Manufacturer: Murata; Manufacturer Part Number: GRM155R61A475MEAAD; Artikkelnr Noca: N.A.; Part Number: C0402-4µ7-10V-X5R; ComponentLink1URL: http://search.murata.co.jp/Ceramy/image/img/A01X/G101/ENG/GRM155R61A475MEAA-01.pdf; ComponentLink1Description: Datasheet; ComponentLink2URL: https://www.digikey.com/product-detail/en/murata-electronics-north-america/GRM155R61A475MEAAD/490-14306-1-ND/6234742; ComponentLink2Description: Supplier link - Digikey; HelpURL: https://psearch.en.murata.com/capacitor/product/GRM155R61A475MEAA%23.html; Footprint Doc: 0402; LatestRevisionDate: 2018-10-04; Pin Count: 2; Publisher: Nordic Semiconductor; Published: 2018-10-04; Value: 4.7µF; Note: 10V; Supplier 1: Digi-Key; Supplier Part Number 1: 490-14306-1-ND; Supplier 2: *; Supplier Part Number 2: *; Part number IPS: N.A.
C40 = C0201-10n: Capacitor, X7R, ±10%; Part number IPS: 00000003480; Note: 10V; Artikkelnr Noca: N.A.; Part Number: C0201-10n; Manufacturer: *; Manufacturer Part Number: *; ComponentLink1URL: *; ComponentLink1Description: Datasheet; ComponentLink2URL: *; ComponentLink2Description: Supplier link; HelpURL: *; Footprint Doc: 0201; LatestRevisionDate: 2017-11-09; Pin Count: 2; Publisher: Nordic Semiconductor; Published: 2014-11-13; Value: 10nF; Supplier 1: *; Supplier Part Number 1: *; Supplier 2: *; Supplier Part Number 2: *
J4 = TC2050-IDC-NLFP: CBL PLUG-OF-NAILS 10-PIN; Manufacturer: Tag-Connect LLC; Artikkelnr Noca: N.A.; Part Number: TC2050-IDC-NLFP; Manufacturer Part Number: TC2050-IDC-NLFP; LatestRevisionDate: 2012-11-21; Publisher: Nordic Semiconductor; Published: 2012-11-21; Value: TC2050-IDC; Pin Count: 10; Footprint Doc: TC2050-IDC-NLFP; Part number IPS: N.A.; ComponentLink1URL: *; ComponentLink1Description: Datasheet; ComponentLink2URL: *; ComponentLink2Description: Supplier link; HelpURL: http://www.tag-connect.com/Materials/TC2050-IDC%20Datasheet.pdf; Supplier 1: Digi-Key; Supplier Part Number 1: TC2050-IDC-NL-ND; Supplier 2: *; Supplier Part Number 2: *
LED5 = LG L29K Smartled Green: LED, Green, 0603, 570nm, Vf=1.7V, 2.24..5.6mcd, - 40 to +100°C; Manufacturer: Osram; Manufacturer Part Number: LG L29K-G2J1-24-Z; Part number IPS: N.A.; Note: 2.24..5.6 mcd, Vfmin=1.7V; Artikkelnr Noca: 13019147; Part Number: LG L29K Smartled Green; Footprint Doc: 0603; LatestRevisionDate: 2017-08-21; Pin Count: 2; Publisher: Nordic Semiconductor; Published: 2014-10-28; Value: L0603G; ComponentLink1URL: *; ComponentLink1Description: Datasheet; ComponentLink2URL: *; ComponentLink2Description: Supplier link; HelpURL: http://www.osram-os.com/Graphics/XPic2/00077107_0.pdf; Supplier 1: Digi-Key; Supplier Part Number 1: 475-2709-1-ND; Supplier 2: Mouser; Supplier Part Number 2: 720-LGL29KG2J124Z
Q1-Q4 = PMCPB5530X,115: Mosfet Array N and P-Channel 20V 4A (Ta), 3.4A (Ta) 490mW Surface Mount 6-HUSON-EP (2x2); Manufacturer: Nexperia; Artikkelnr Noca: N.A.; Part Number: PMCPB5530X,115; Manufacturer Part Number: PMCPB5530X,115; ComponentLink1URL: https://assets.nexperia.com/documents/data-sheet/PMCPB5530X.pdf; ComponentLink1Description: Datasheet; ComponentLink2URL: https://www.digikey.com/product-detail/en/nexperia-usa-inc/PMCPB5530X115/1727-1327-1-ND/4386339; ComponentLink2Description: Supplier link; HelpURL: https://www.nexperia.com/products/mosfets/small-signal-mosfets/PMCPB5530X.html; Footprint Doc: 6-UDFN; LatestRevisionDate: 2018-04-30; Pin Count: 8; Publisher: Nordic Semiconductor; Published: 2018-04-30; Value: PMCPB5530; Note: *; Supplier 1: Digi-Key; Supplier Part Number 1: 1727-1327-1-ND; Supplier 2: Mouser; Supplier Part Number 2: 771-PMCPB5530X115; Part number IPS: N.A.
R6 R32 R34 R37 R39-R41 = R0201-100k: Resistor, ±1%, 0.05W; Part number IPS: 00000001419; Note: Chip Res 1%; Artikkelnr Noca: N.A.; Part Number: R0201-100k; Manufacturer: *; Manufacturer Part Number: *; ComponentLink1URL: *; ComponentLink1Description: Datasheet; ComponentLink2URL: *; ComponentLink2Description: Supplier link; HelpURL: *; Footprint Doc: 0201; LatestRevisionDate: 2014-11-13; Pin Count: 2; Publisher: Nordic Semiconductor; Published: 2014-11-13; Value: 100k; Supplier 1: *; Supplier Part Number 1: *; Supplier 2: *; Supplier Part Number 2: *
R7-R10 R26 = R0201-10k: Resistor, ±1%, 0.05W; Part number IPS: 00000001255; Note: Chip Res 1%; Artikkelnr Noca: N.A.; Part Number: R0201-10k; Manufacturer: *; Manufacturer Part Number: *; Footprint Doc: 0201; LatestRevisionDate: 2014-11-13; Pin Count: 2; Publisher: Nordic Semiconductor; Published: 2014-11-13; Value: 10k; ComponentLink1URL: *; ComponentLink1Description: Datasheet; ComponentLink2URL: *; ComponentLink2Description: Supplier link; HelpURL: *; Supplier 1: *; Supplier Part Number 1: *; Supplier 2: *; Supplier Part Number 2: *
R11 = R0201-120: Resistor, ±1%, 0.05W; Note: Chip Res 1%; Artikkelnr Noca: N.A.; Part Number: R0201-120; Manufacturer: *; Manufacturer Part Number: *; ComponentLink1URL: *; ComponentLink1Description: Datasheet; ComponentLink2URL: *; ComponentLink2Description: Supplier link; HelpURL: *; Footprint Doc: 0201; LatestRevisionDate: 2014-11-13; Pin Count: 2; Publisher: Nordic Semiconductor; Published: 2014-11-13; Value: 120R; Supplier 1: *; Supplier Part Number 1: *; Supplier 2: *; Supplier Part Number 2: *; Part number IPS: N.A.
R12 = R0201-N.C.: Not mounted; Note: Chip Res; Artikkelnr Noca: N.A.; Assembly: Not mounted; Part Number: R0201-N.C.; Manufacturer: *; Manufacturer Part Number: *; ComponentLink1URL: *; ComponentLink1Description: Datasheet; ComponentLink2URL: *; ComponentLink2Description: Supplier link; HelpURL: *; Footprint Doc: 0201; LatestRevisionDate: 2014-11-13; Pin Count: 2; Publisher: Nordic Semiconductor; Published: 2014-11-13; Value: N.C.; Supplier 1: *; Supplier Part Number 1: *; Supplier 2: *; Supplier Part Number 2: *; Part number IPS: N.A.
R13 R31 R36 = R0201-1M0: Resistor, ±1%, 0.05W; Note: Chip Res 1%; Artikkelnr Noca: N.A.; Part Number: R0201-1M0; Manufacturer: *; Manufacturer Part Number: *; ComponentLink1URL: *; ComponentLink1Description: Datasheet; ComponentLink2URL: *; ComponentLink2Description: Supplier link; HelpURL: *; Footprint Doc: 0201; LatestRevisionDate: 2014-11-13; Pin Count: 2; Publisher: Nordic Semiconductor; Published: 2014-11-13; Value: 1M0; Supplier 1: *; Supplier Part Number 1: *; Supplier 2: *; Supplier Part Number 2: *; Part number IPS: N.A.
R14 R17-R19 R21-R23 R25 R27 R28 R30 R33 R35 R38 R76 = R0201-150: Resistor, ±1%, 0.05W; Note: Chip Res 1%; Artikkelnr Noca: N.A.; Part Number: R0201-150; Manufacturer: *; Manufacturer Part Number: *; ComponentLink1URL: *; ComponentLink1Description: Datasheet; ComponentLink2URL: *; ComponentLink2Description: Supplier link; HelpURL: *; Footprint Doc: 0201; LatestRevisionDate: 2014-11-13; Pin Count: 2; Publisher: Nordic Semiconductor; Published: 2014-11-13; Value: 150R; Part number IPS: N.A.; Supplier 1: *; Supplier Part Number 1: *; Supplier 2: *; Supplier Part Number 2: *
R15 R16 = R0201-33R: Resistor, ±1%, 0.05W; Note: Chip Res 1%; Artikkelnr Noca: N.A.; Part Number: R0201-33R; Manufacturer: *; Manufacturer Part Number: *; ComponentLink1URL: *; ComponentLink1Description: Datasheet; ComponentLink2URL: *; ComponentLink2Description: Supplier link; HelpURL: *; Footprint Doc: 0201; LatestRevisionDate: 2014-11-13; Pin Count: 2; Publisher: Nordic Semiconductor; Published: 2014-11-13; Value: 33R; Part number IPS: N.A.; Supplier 1: *; Supplier Part Number 1: *; Supplier 2: *; Supplier Part Number 2: *
R29 = R0201-0R: as L8 on sheet pca10095_sheet2_nrf5340_mcu; Part Number: R0201-0R; Manufacturer: *; Manufacturer Part Number: *; ComponentLink1URL: *; ComponentLink1Description: Datasheet; ComponentLink2URL: *; ComponentLink2Description: Supplier link; HelpURL: *; Footprint Doc: 0201; LatestRevisionDate: 2017-11-09; Pin Count: 2; Publisher: Nordic Semiconductor; Published: 2014-11-13; Value: 0R; Supplier 1: *; Supplier Part Number 1: *; Supplier 2: *; Supplier Part Number 2: *
SB19 = Solderbridge Shorted: as SB1 on sheet pca10095_sheet2_nrf5340_mcu; Part Number: Solderbridge Shorted; Manufacturer: *; Manufacturer Part Number: *; ComponentLink1URL: *; ComponentLink1Description: Datasheet; ComponentLink2URL: *; ComponentLink2Description: Supplier link; HelpURL: *; Footprint Doc: Solderbridge_Shorted; LatestRevisionDate: 2012-08-07; Pin Count: 2; Publisher: Nordic Semiconductor; Published: 2012-08-07; Value: Solderbridge; Note: *; Supplier 1: *; Supplier Part Number 1: *; Supplier 2: *; Supplier Part Number 2: *; Part number IPS: N.A.
TP20 TP21 TP23 TP48 TP49 = TP_SMD_Ø1.5MM: 1.0mm circular SMD testpad; Manufacturer: Nordic Semiconductor; Artikkelnr Noca: N.A.; Part Number: TP_SMD_Ø1.5MM; Manufacturer Part Number: *; ComponentLink1URL: *; ComponentLink1Description: Datasheet; ComponentLink2URL: *; ComponentLink2Description: Supplier link; HelpURL: *; Footprint Doc: TP_SMD_Ø1.5mm; LatestRevisionDate: 2016-06-02; Pin Count: 1; Publisher: Nordic Semiconductor; Published: 2016-06-02; Value: Ø1.5mm,SMD; Note: *; Part number IPS: N.A.; Supplier 1: *; Supplier Part Number 1: *; Supplier 2: *; Supplier Part Number 2: *
TP50-TP53 = TP_SMD_Ø1.0MM: 1.0mm circular SMD testpad; Manufacturer: Nordic Semiconductor; Artikkelnr Noca: N.A.; Part Number: TP_SMD_Ø1.0MM; Manufacturer Part Number: *; LatestRevisionDate: 2013-06-11; Pin Count: 1; Publisher: Nordic Semiconductor; Published: 2013-06-11; Value: Ø1.0mm,SMD; Note: *; Footprint Doc: TP_SMD_Ø1.0mm; Part number IPS: N.A.; ComponentLink1URL: *; ComponentLink1Description: Datasheet; ComponentLink2URL: *; ComponentLink2Description: Supplier link; HelpURL: *; Supplier 1: *; Supplier Part Number 1: *; Supplier 2: *; Supplier Part Number 2: *
U2 = MK22FN128VLL10: 100MHz Cortex-M4F Performance MCU, 128kB Flash, 24kB SRAM, Full-Speed USB; Manufacturer: NXP; Part number IPS: 00000001366; Artikkelnr Noca: N.A.; Part Number: MK22FN128VLL10; Manufacturer Part Number: MK22FN128VLL10; ComponentLink1URL: http://cache.freescale.com/files/microcontrollers/doc/data_sheet/K22P121M100SF9.pdf; ComponentLink1Description: Datasheet; ComponentLink2URL: https://cache.nxp.com/docs/en/package-information/98ASS23308W.pdf; ComponentLink2Description: Supplier link; HelpURL: *; Footprint Doc: LQFP-100; LatestRevisionDate: 2019-03-01; Pin Count: 100; Publisher: Nordic Semiconductor; Published: 2018-05-10; Value: MK22FN128VLL10; Note: *; Supplier 1: Digi-Key; Supplier Part Number 1: MK22FN128VLL10-ND; Supplier 2: Mouser; Supplier Part Number 2: 841-MK22FN128VLL10
U8 = DG2034EDN: POWER DOWN FAULT PROTECTED,1.8VT; Manufacturer: Vishay Siliconix; Manufacturer Part Number: DG2034EDN-T1-GE4; Artikkelnr Noca: N.A.; Part Number: DG2034EDN; ComponentLink1URL: http://www.vishay.com/docs/73172/dg2034e.pdf; ComponentLink1Description: Datasheet; ComponentLink2Description: Supplier link; Footprint Doc: 12-QFN; LatestRevisionDate: 2018-05-30; Pin Count: 12; Publisher: Nordic Semiconductor; Published: 2018-05-30; Value: DG2034EDN; Note: *; Part number IPS: N.A.; Supplier 1: Digi-Key; Supplier Part Number 1: DG2034EDN-T1-GE4CT-ND; Supplier 2: Mouser; Supplier Part Number 2: 78-DG2034EDN-T1-GE4